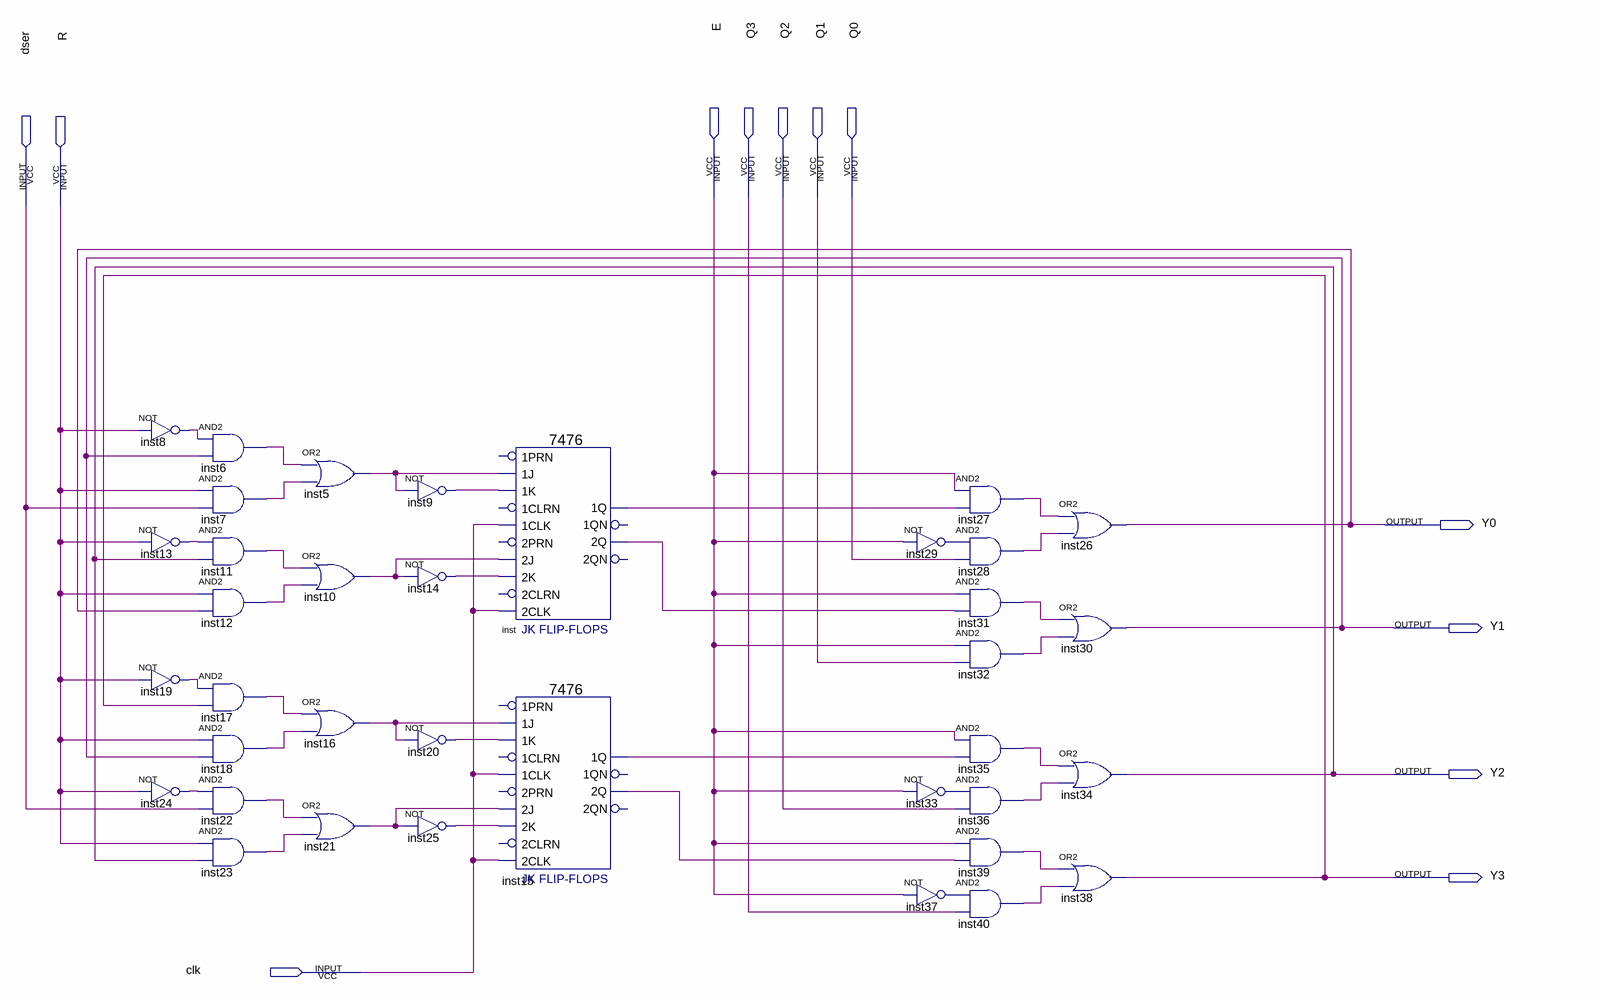
[diagram p0: schematic sheet]
// Quartus schematic Problema52.bdf as structural Verilog: 37 symbols, 12 pins
module Problema52 (
  input  E,
  input  Q3,
  input  Q2,
  input  Q1,
  input  Q0,
  input  dser,
  input  R,
  input  clk,
  output Y0,
  output Y1,
  output Y2,
  output Y3
);

  wire inst5_out, inst6_out, inst7_out, inst8_out, inst9_out, inst10_out, inst11_out, inst12_out, inst13_out,
       inst14_out, inst15_1q, inst15_2q, inst16_out, inst17_out, inst18_out, inst19_out, inst20_out,
       inst21_out, inst22_out, inst23_out, inst24_out, inst25_out, inst27_out, inst28_out, inst29_out,
       inst31_out, inst32_out, inst33_out, inst35_out, inst36_out, inst37_out, inst39_out, inst40_out,
       inst_1q, inst_2q;

  not inst8 (inst8_out, R);
  and inst6 (inst6_out, inst8_out, Y1);
  and inst7 (inst7_out, R, dser);
  and inst11 (inst11_out, inst13_out, Y2);
  not inst13 (inst13_out, R);
  and inst12 (inst12_out, R, Y0);
  not inst19 (inst19_out, R);
  and inst17 (inst17_out, inst19_out, Y3);
  and inst18 (inst18_out, R, Y1);
  and inst22 (inst22_out, inst24_out, dser);
  not inst24 (inst24_out, R);
  and inst23 (inst23_out, R, Y2);
  or inst5 (inst5_out, inst6_out, inst7_out);
  or inst10 (inst10_out, inst11_out, inst12_out);
  or inst16 (inst16_out, inst17_out, inst18_out);
  or inst21 (inst21_out, inst22_out, inst23_out);
  not inst9 (inst9_out, inst5_out);
  not inst14 (inst14_out, inst10_out);
  not inst20 (inst20_out, inst16_out);
  not inst25 (inst25_out, inst21_out);
  \7476  inst (
    .\1J (inst5_out), .\1K (inst9_out), .\2J (inst10_out), .\1CLK (clk), .\2K (inst14_out), .\2CLK (clk),
    .\1Q (inst_1q), .\2Q (inst_2q));  // open: 1PRN, 2PRN, 1CLRN, 2CLRN, 2QN, 1QN
  \7476  inst15 (
    .\1J (inst16_out), .\1K (inst20_out), .\2J (inst21_out), .\1CLK (clk), .\2K (inst25_out), .\2CLK (clk),
    .\1Q (inst15_1q), .\2Q (inst15_2q));  // open: 1PRN, 2PRN, 1CLRN, 2CLRN, 2QN, 1QN
  and inst27 (inst27_out, E, inst_1q);
  and inst28 (inst28_out, inst29_out, Q0);
  not inst29 (inst29_out, E);
  and inst31 (inst31_out, E, inst_2q);
  and inst32 (inst32_out, E, Q1);
  and inst35 (inst35_out, E, inst15_1q);
  and inst36 (inst36_out, inst33_out, Q2);
  not inst33 (inst33_out, E);
  and inst39 (inst39_out, E, inst15_2q);
  and inst40 (inst40_out, inst37_out, Q3);
  not inst37 (inst37_out, E);
  or inst26 (Y0, inst27_out, inst28_out);
  or inst30 (Y1, inst31_out, inst32_out);
  or inst34 (Y2, inst35_out, inst36_out);
  or inst38 (Y3, inst39_out, inst40_out);
endmodule
